# EAGLE design untitled (EAGLE 9.6.2)
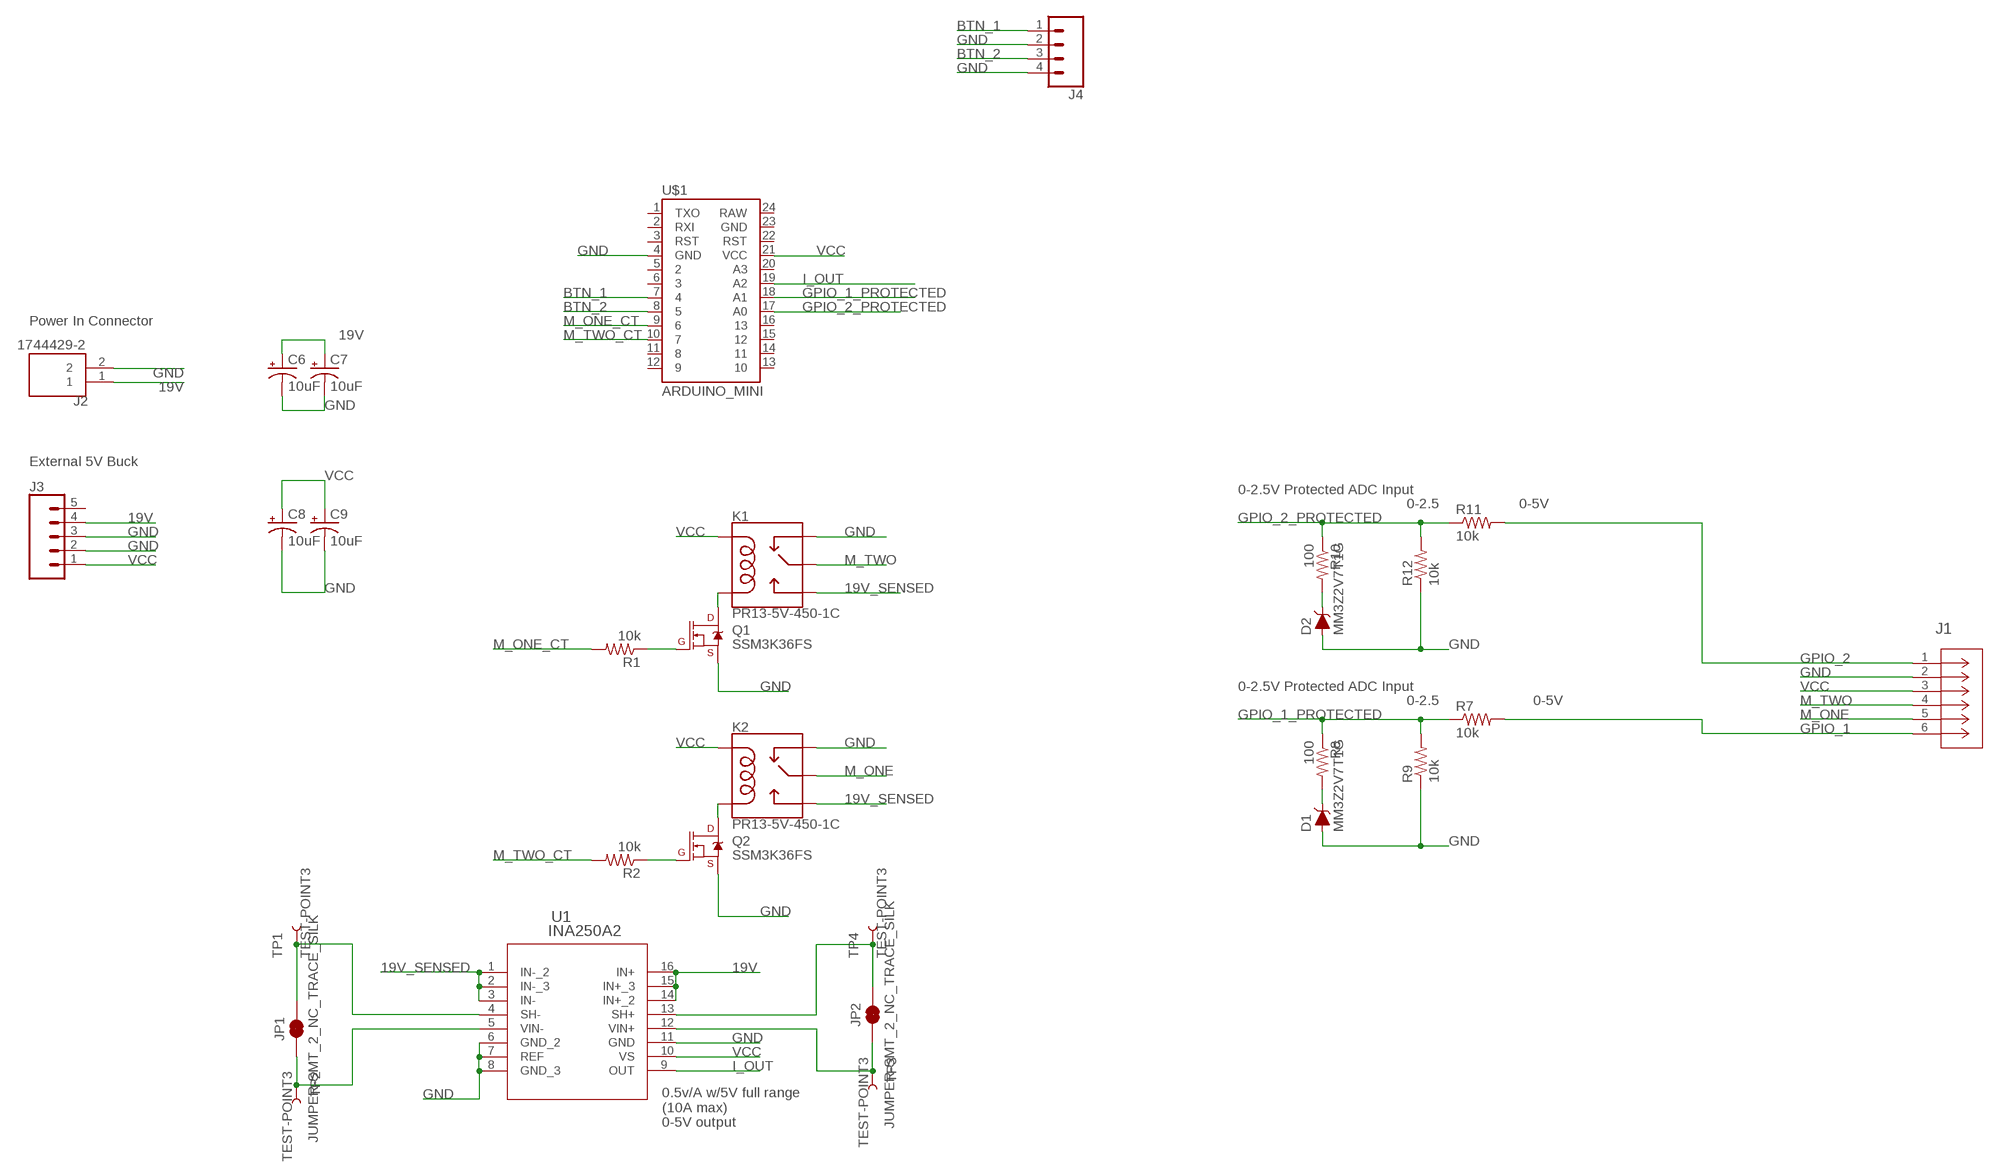
[diagram p0: schematic, sheet 1]

## Parts
C6  10uF  CPOL-USE2.5-6  [E2,5-6]
C7  10uF  CPOL-USE2.5-6  [E2,5-6]
C8  10uF  CPOL-USE2.5-6  [E2,5-6]
C9  10uF  CPOL-USE2.5-6  [E2,5-6]
D1  MM3Z2V7T1G  DIODE-ZENER-BZT52C3V6S  [SOD-323]
D2  MM3Z2V7T1G  DIODE-ZENER-BZT52C3V6S  [SOD-323]
J1  39301060  [CON_39301060]
J2  1744429-2  [TE_1744429-2]
J3  CONN_05  [1X05]
J4  CONN_041X04_NO_SILK  [1X04_NO_SILK]
JP1  JUMPER-SMT_2_NC_TRACE_SILK  [SMT-JUMPER_2_NC_TRACE_SILK]
JP2  JUMPER-SMT_2_NC_TRACE_SILK  [SMT-JUMPER_2_NC_TRACE_SILK]
K1  PR13-5V-450-1C  RELAY-SPDT  [RELAY_G5LE]
K2  PR13-5V-450-1C  RELAY-SPDT  [RELAY_G5LE]
Q1  SSM3K36FS  MOSFET-NCH-AO3404A  [SOT23-3]
Q2  SSM3K36FS  MOSFET-NCH-AO3404A  [SOT23-3]
R1  10k  R-US_R0805  [R0805]
R2  10k  R-US_R0805  [R0805]
R7  10k  R-US_R0805  [R0805]
R8  100  R-US_R0805  [R0805]
R9  10k  R-US_R0805  [R0805]
R10  100  R-US_R0805  [R0805]
R11  10k  R-US_R0805  [R0805]
R12  10k  R-US_R0805  [R0805]
TP1  TEST-POINT3  [PAD.03X.03]
TP2  TEST-POINT3  [PAD.03X.03]
TP3  TEST-POINT3  [PAD.03X.03]
TP4  TEST-POINT3  [PAD.03X.03]
U1  INA250A2  INA250A1PWPW16_TEX-M  [PW16_TEX-M]
U$1  ARDUINO_MINI  [ARDUINO_MINI]

## Nets
19V: C6.+ C7.+ J2.1 J3.4 U1.14(IN+_2) U1.15(IN+_3) U1.16(IN+)
19V_SENSED: K1.3(NO) K2.3(NO) U1.1(IN-_2) U1.2(IN-_3) U1.3(IN-)
BTN_1: J4.1 U$1.7
BTN_2: J4.3 U$1.8
GND: C6.- C7.- C8.- C9.- D1.A D2.A J1.2 J2.2 J3.2 J3.3 J4.2 J4.4 K1.4(NC) K2.4(NC) Q1.2(S) Q2.2(S) R9.1 R12.1 U1.6(GND_2) U1.7(REF) U1.8(GND_3) U1.11(GND) U$1.4(GND)
GPIO_1: J1.6 R7.2
GPIO_1_PROTECTED: R7.1 R8.1 R9.2 U$1.18(A1)
GPIO_2: J1.1 R11.2
GPIO_2_PROTECTED: R10.1 R11.1 R12.2 U$1.17(A0)
I_OUT: U1.9(OUT) U$1.19(A2)
M_ONE: J1.5 K2.1(MAIN)
M_ONE_CT: R1.2 U$1.9
M_TWO: J1.4 K1.1(MAIN)
M_TWO_CT: R2.2 U$1.10
N$1: JP1.1 TP2.1 U1.5(VIN-)
N$2: JP1.2 TP1.1 U1.4(SH-)
N$3: JP2.2 TP4.1 U1.13(SH+)
N$4: K1.5(COIL2) Q1.3(D)
N$5: K2.5(COIL2) Q2.3(D)
N$6: Q2.1(G) R2.1
N$7: D1.C R8.2
N$8: Q1.1(G) R1.1
N$9: D2.C R10.2
N$10: JP2.1 TP3.1 U1.12(VIN+)
VCC: C8.+ C9.+ J1.3 J3.1 K1.2(COIL1) K2.2(COIL1) U1.10(VS) U$1.21(VCC)
Unconnected: J3.5 U$1.1(TXO) U$1.2(RXI) U$1.3(RST) U$1.5 U$1.6 U$1.11 U$1.12 U$1.13 U$1.14 U$1.15 U$1.16 U$1.20(A3) U$1.22(RST) U$1.23(GND) U$1.24(RAW)

## Notes on the sheet
- Power In Connector
- External 5V Buck
- 0-2.5V Protected ADC Input
- 0-2.5 | 0-5V
- 0-2.5V Protected ADC Input
- 0-2.5 | 0-5V
- 0.5v/A w/5V full range
  (10A max)
  0-5V output

## Library data of the parts
C6-C9 = adafruit:CPOL-US: POLARIZED CAPACITOR, American symbol
D1 D2 = SparkFun-DiscreteSemi:DIODE-ZENER: Zener Diode A Zener diode allows current to flow from its anode to its cathode like a normal semiconductor diode, but it also permits current to flow in the reverse direction when its "Zener voltage" is reached. - WIkipedia; PROD_ID: DIO-08199; VALUE: 3.6V
J1 = 39301060:39301060; COPYRIGHT: Copyright (C) 2022 Ultra Librarian. All rights reserved.; MANUFACTURER_PART_NUMBER: 39301060; MFR_NAME: Molex Connector Corporation
J2 = 1744429-2:1744429-2: 3.96 EP HDR ASSY 6P W/PEGS, GW,NO PIN 3; MANUFACTURER: TE; PARTREV: R; STANDARD: Manufacturer Recommendations
J3 = SparkFun-Connectors:CONN_05: Multi connection point. Often used as Generic Header-pin footprint for 0.1 inch spaced/style header connections On any of the 0.1 inch spaced packages, you can populate with these: Break Away Headers - Straight <https://www.sparkfun.com/products/116> (PRT-00116) Break Away Male Headers - Right Angle <https://www.sparkfun.com/products/553> (PRT-00553) Female Headers <https://www.sparkfun.com/products/115> (PRT-00115) Break Away Headers - Machine Pin <https://www.sparkfun.com/products/117> (PRT-00117) Break Away Female Headers - Swiss Machine Pin <https://www.sparkfun.com/products/743> (PRT-00743) For SCREWTERMINALS and SPRING TERMINALS visit here: Screw Terimnals on SparkFun.com <https://www.sparkfun.com/search/results?term=Screw+Terminals> (5mm/3.5mm/2.54mm spacing) This device is also useful as a general connection point to wire up your design to another part of your project. Our various solder wires solder well into these plated through hole pads. Hook-Up Wire - Assortment (Stranded, 22 AWG) <https://www.sparkfun.com/products/11375> (PRT-11375) Hook-Up Wire - Assortment (Solid Core, 22 AWG) <https://www.sparkfun.com/products/11367> (PRT-11367) View the entire wire category on our website here <https://www.sparkfun.com/categories/141> Special notes: Molex polarized connector foot print use with SKU : PRT-08231 with associated crimp pins and housings. 1MM SMD Version SKU: PRT-10208
J4 = SparkFun-Connectors:CONN_04: Multi connection point. Often used as Generic Header-pin footprint for 0.1 inch spaced/style header connections On any of the 0.1 inch spaced packages, you can populate with these: Break Away Headers - Straight <https://www.sparkfun.com/products/116> (PRT-00116) Break Away Male Headers - Right Angle <https://www.sparkfun.com/products/553> (PRT-00553) Female Headers <https://www.sparkfun.com/products/115> (PRT-00115) Break Away Headers - Machine Pin <https://www.sparkfun.com/products/117> (PRT-00117) Break Away Female Headers - Swiss Machine Pin <https://www.sparkfun.com/products/743> (PRT-00743) For SCREWTERMINALS and SPRING TERMINALS visit here: Screw Terimnals on SparkFun.com <https://www.sparkfun.com/search/results?term=Screw+Terminals> (5mm/3.5mm/2.54mm spacing) This device is also useful as a general connection point to wire up your design to another part of your project. Our various solder wires solder well into these plated through hole pads. Hook-Up Wire - Assortment (Stranded, 22 AWG) <https://www.sparkfun.com/products/11375> (PRT-11375) Hook-Up Wire - Assortment (Solid Core, 22 AWG) <https://www.sparkfun.com/products/11367> (PRT-11367) View the entire wire category on our website here <https://www.sparkfun.com/categories/141> Special notes: Molex polarized connector foot print use with SKU : PRT-08231 with associated crimp pins and housings. 1MM SMD Version SKU: PRT-10208; PROD_ID: CONN-09696
JP1 JP2 = SparkFun-Jumpers:JUMPER-SMT_2_NC_TRACE: Normally closed trace jumper This jumper has a trace between two pads so it's normally closed (NC). Use a razor knife to open the connection. For best results follow the IPC guidelines for cutting traces: Cutout at least 0.063 mm (0.005 in). Remove all loose material to clean up the cut area. Seal the cut with an approved epoxy. Reapply solder to reclose the connection.
K1 K2 = SparkFun-Electromechanical:RELAY-SPDT: SPDT Electromechanical Relay Single-pole, double-throw sealed relays. When current is applied to the coil, it throws a simple changeover switch, terminating the connection from the NC contact to ground and closing the NO contact. Use them to switch high voltage/high current devices. SparkFun Products JQX-15F: Relay SPDT Sealed - 20A <https://www.sparkfun.com/products/10924> (COM-10924) JZC-11F: Relay SPDT Sealed <https://www.sparkfun.com/products/100> (COM-00100); PROD_ID: COMP-14214
Q1 Q2 = SparkFun-DiscreteSemi:MOSFET-NCH: N-channel MOSFETs Voltage controlled devices that allow control of high current outputs. SparkFun Products: SparkFun OpenScale <https://www.sparkfun.com/products/13261> SparkFun Digital Sandbox <https://www.sparkfun.com/products/12651> SparkFun Monster Moto Shield <https://www.sparkfun.com/products/10182> SparkFun MOSFET Power Controller <https://www.sparkfun.com/products/11214>; PROD_ID: TRANS-12988; VALUE: 5.8A/30V/35mΩ
R1 R2 R7-R12 = adafruit:R-US_: RESISTOR, American symbol
TP1-TP4 = SparkFun-Connectors:TEST-POINT: SparkFun Test Points Bare copper test points for troubleshooting or In-Circuit-Testing. These are used by our Production team for verifying production board runs using pogo-pins on test beds. SparkFun Products: SparkFun LSM9DS1 Breakout <https://www.sparkfun.com/products/13284> SparkFun PSOC <https://www.sparkfun.com/products/13714> SparkFun Load Cell Amplifier <https://www.sparkfun.com/products/13879>
U1 = INA250:INA250A1PW; COPYRIGHT: Copyright (C) 2022 Ultra Librarian. All rights reserved.; MANUFACTURER_PART_NUMBER: INA250A1PW; MFR_NAME: Texas Instruments
U$1 = SparkFun-Retired:ARDUINO_MINI: Arduino Pro Mini footprint

## Board
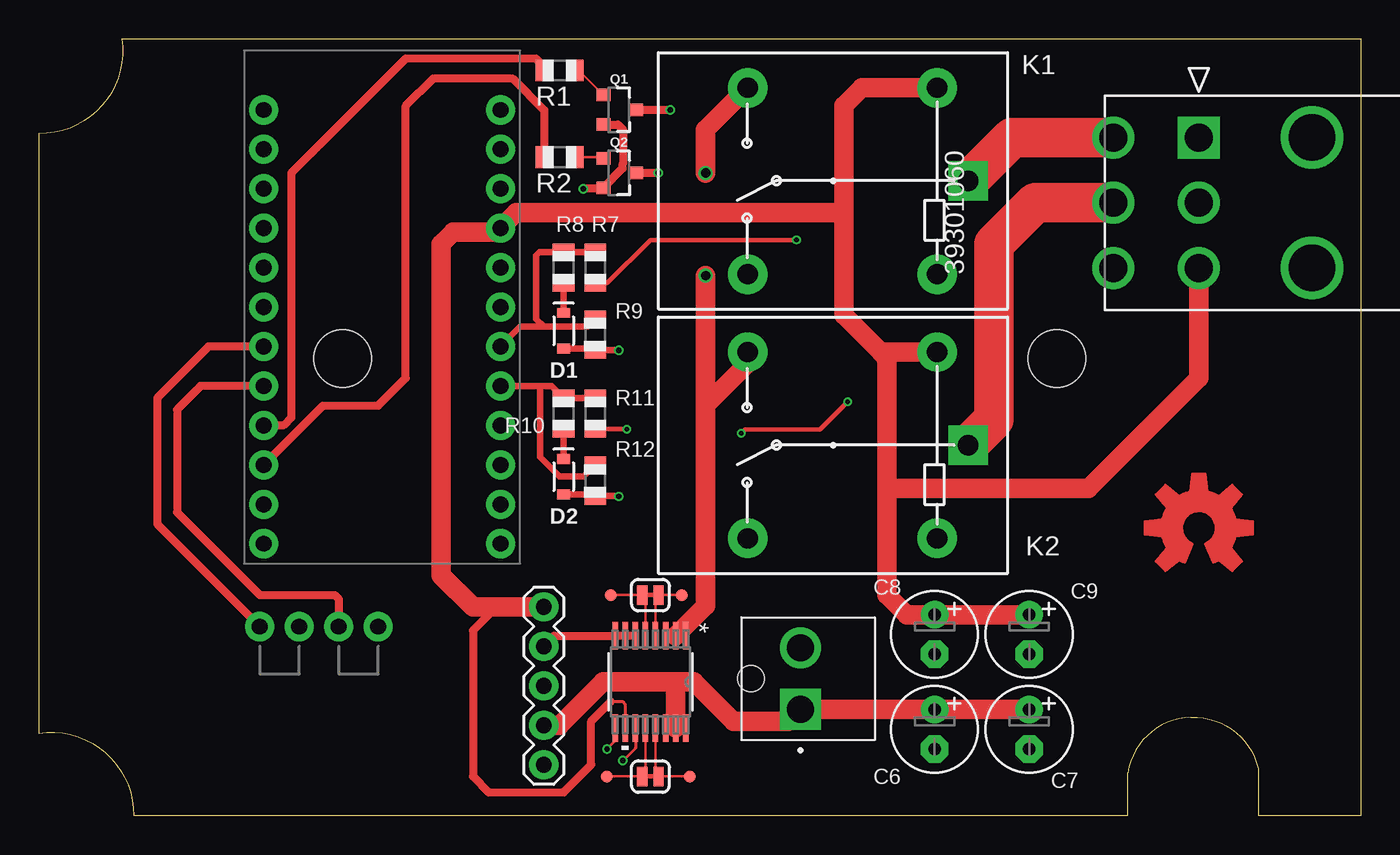
[diagram p1: board, top side]
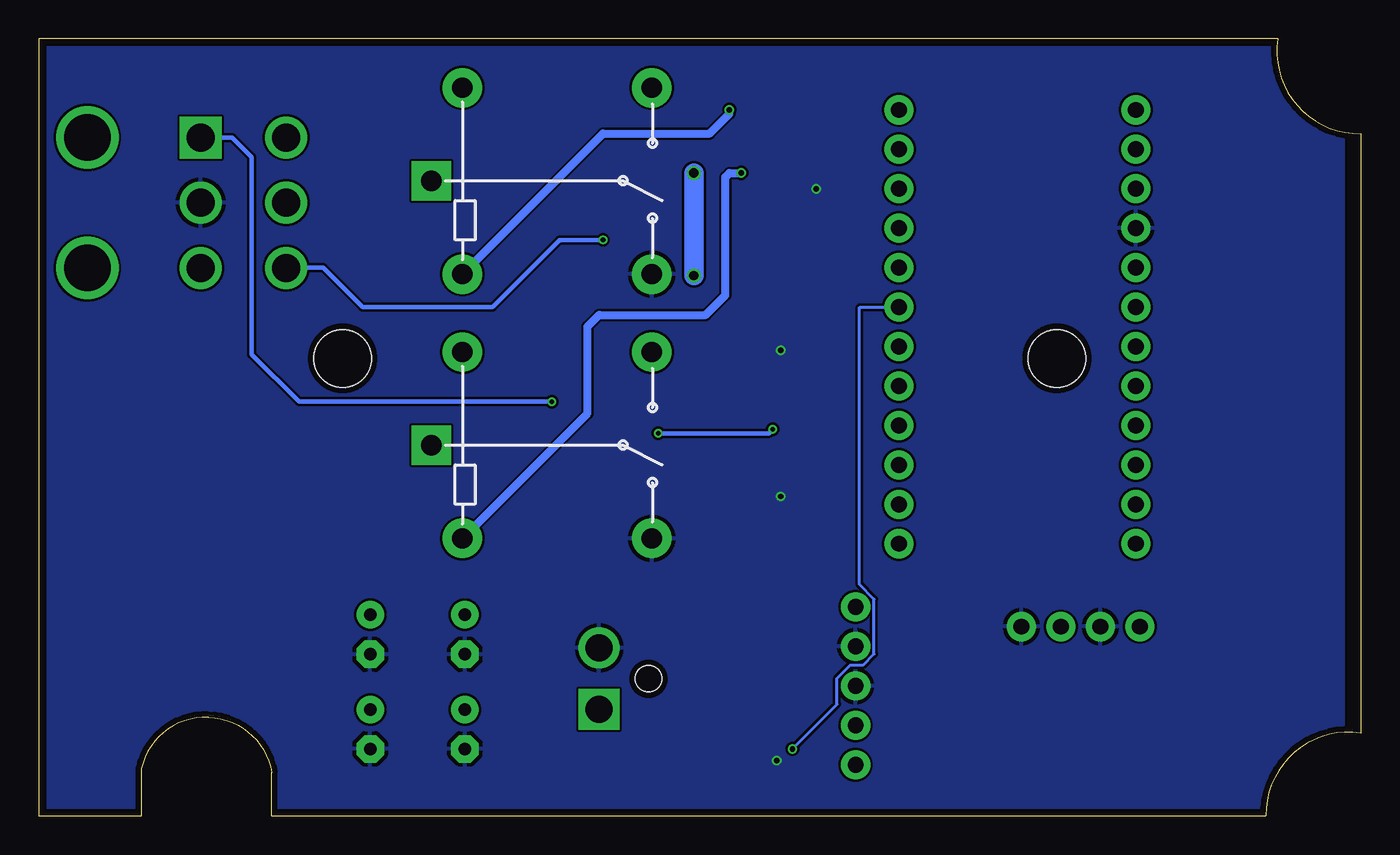
[diagram p2: board, bottom side, seen from below]

Size 85.09 x 50.04 mm. Coordinates in mm from the lower left corner, seen from the top.
Outline: 5.33,50.04 arc-100 0,43.94 0,5.33 arc-100 6.1,0 70.1,0 70.1,2.79 arc-80 74.17,6.35 arc-80 78.49,3.05 78.49,0 85.09,0 85.09,50.04 5.33,50.04
Copper layers (1*16): Top 0.035559375mm / dielectric 1.6mm / Bottom 0.035559375mm
Design rules "oshpark-2layer": minimum track width 6mil, minimum drill 10mil, track to track 6mil, track to pad 6mil, pad to pad 6mil, via to via 6mil, smd to smd 6mil, copper to edge 15mil, drill to drill 6mil, minimum pad ring 5mil, minimum via ring 5mil, stop-mask expansion 2.5mil, vias tented up to drill 0mil, thermal gap 10mil
Holes 3.7 mm at 19.56,29.46 65.53,29.46

### Footprints (pad centres in the part's own frame; a part is rotated, then mirrored left to right if it is on the bottom)
E2,5-6 = drill 0.813 pad 1.778: + -1.27,0 | drill 0.813 pad 1.778 octagon: - 1.27,0
SOD-323 = smd 0.63 x 0.83: A 1.15,0; C -1.15,0
CON_39301060 = drill 1.803 pad 2.311 square: 1 0,0 | drill 1.803 pad 2.311: 2 -4.191,0; 3 -8.407,0; 4 0,5.512; 5 -4.191,5.512; 6 -8.407,5.512 | drill 2.997 pad 2.997: M1 0,-7.29; M2 -8.407,-7.29
TE_1744429-2 = drill 1.75 pad 2.1 square: 1 0,0 | drill 1.75 pad 2.1: 2 3.96,0 | hole 1.68: 1.98,3.18; 1.98,3.18
1X05 = drill 1.016 pad 1.88: 1 0,0; 2 2.54,0; 3 5.08,0; 4 7.62,0; 5 10.16,0
1X04_NO_SILK = drill 1.016 pad 1.88: 1 0,0; 2 2.54,0; 3 5.08,0; 4 7.62,0
SMT-JUMPER_2_NC_TRACE_SILK = smd 0.66 x 1.27: 1 -0.521,0; 2 0.521,0
RELAY_G5LE = drill 1.3 pad 2.54 square: 1 8.52,-0.005 | drill 1.3 pad 2.54: 2 6.52,5.995; 3 -5.68,5.995; 4 -5.68,-6.005; 5 6.52,-6.005
SOT23-3 = smd 0.8 x 0.9: 1 -0.95,-1; 2 0.95,-1; 3 0,1.1
R0805 = smd 1.1 x 1.4: 1 -1,0; 2 1,0
PAD.03X.03 = smd 0.762 x 0.762: 1 0,0
PW16_TEX-M = smd 1.778 x 0.356: 1 -2.972,2.275; 2 -2.972,1.625; 3 -2.972,0.975; 4 -2.972,0.325; 5 -2.972,-0.325; 6 -2.972,-0.975; 7 -2.972,-1.625; 8 -2.972,-2.275; 9 2.972,-2.275; 10 2.972,-1.625; 11 2.972,-0.975; 12 2.972,-0.325; 13 2.972,0.325; 14 2.972,0.975; 15 2.972,1.625; 16 2.972,2.275
ARDUINO_MINI = drill 1.016 pad 1.88: 1 -7.62,12.7; 2 -7.62,10.16; 3 -7.62,7.62; 4 -7.62,5.08; 5 -7.62,2.54; 6 -7.62,0; 7 -7.62,-2.54; 8 -7.62,-5.08; 9 -7.62,-7.62; 10 -7.62,-10.16; 11 -7.62,-12.7; 12 -7.62,-15.24; 13 7.62,-15.24; 14 7.62,-12.7; 15 7.62,-10.16; 16 7.62,-7.62; 17 7.62,-5.08; 18 7.62,-2.54; 19 7.62,0; 20 7.62,2.54; 21 7.62,5.08; 22 7.62,7.62; 23 7.62,10.16; 24 7.62,12.7

### Placement (x,y rotation side)
C6  57.66,5.59 270 top
C7  63.75,5.59 270 top
C8  57.66,11.68 270 top
C9  63.75,11.68 270 top
D1  33.78,31.24 270 top
D2  33.78,21.84 270 top
J1  74.68,43.69 90 top
J2  49.02,6.86 90 top
J3  32.51,13.46 270 top
J4  14.22,12.19 0 top
JP1  39.37,14.22 0 top
JP2  39.37,2.54 0 top
K1  51.31,40.89 0 top
K2  51.31,23.88 0 top
Q1  37.34,45.47 270 top
Q2  37.34,41.4 270 top
R1  33.53,48.01 180 top
R2  33.53,42.42 180 top
R7  35.81,35.31 270 top
R8  33.78,35.31 270 top
R9  35.81,30.99 90 top
R10  33.78,25.91 270 top
R11  35.81,25.91 270 top
R12  35.81,21.59 90 top
TP1  41.4,14.22 0 top
TP2  36.83,14.22 0 top
TP3  36.58,2.54 0 top
TP4  41.91,2.54 0 top
U1  39.37,8.64 270 top
U$1  22.1,32.77 0 top
U$2  [OSHW-LOGO-L_COPPER]  74.68,18.54 0 top

### Tracks (layer width: path | path; a pad name or v marks a point on that pad's centre or on a via)
19V
  Top 0.254: U1.14 U1.15 U1.16
  Top 1.27: J3.4 33.53,5.84 36.32,8.64 40.89,8.64 | 40.89,8.64 42.16,8.64 44.7,6.1 48.26,6.1 J2.1 C6.+ C7.+ | U1.15 40.99,8.54 40.89,8.64
19V_SENSED  (via drill 0.6)
  Top 0.254: U1.3 U1.2 U1.1
  Top 1.27: U1.2 42.93,13.54 42.93,26.42 | K1.3 42.93,44.19 v42.93,41.4 | K2.3 45.63,29.12 42.93,26.42 | v42.93,34.8 42.93,26.42
  Bottom 1.27: v42.93,41.4 v42.93,34.8
BTN_1
  Top 0.508: U$1.7 10.92,30.23 7.62,26.92 7.62,18.8 J4.1
BTN_2
  Top 0.508: U$1.8 10.41,27.69 8.89,26.16 8.89,19.56 14.22,14.22 19.05,14.22 19.3,13.97 J4.3
GND  (via drill 0.35)
  Top 0.203: U1.11 38.4,4.36 v37.59,3.56
  Top 0.254: U1.7 U1.6
  Top 0.406: D1.A 35.71,30.09 R9.1 37.32,29.99 v37.34,29.97 | D2.A 35.71,20.69 R12.1 37.32,20.59 v37.34,20.57
  Top 0.508: Q1.2 37.27,44.52 37.59,44.2 37.59,41.98 37.58,41.97 37.58,41.7 Q2.2 36.27,40.39 v35.05,40.39 | J3.2 33.2,11.61 U1.8 U1.6
  pour Bottom: 1.02,49.53 84.58,49.53 84.58,0.51 1.02,0.51
GPIO_1  (via drill 0.3)
  Top 0.305: R7.2 36.59,34.31 39.37,37.08 v48.77,37.08
  Bottom 0.305: v48.77,37.08 51.56,37.08 55.88,32.77 64.26,32.77 66.8,35.31 69.14,35.31 J1.6
GPIO_1_PROTECTED
  Top 0.406: R7.1 R8.1 32.24,36.31 32,36.07 32,32 32.51,31.5 | 32.51,31.5 35.32,31.5 R9.2 | U$1.18 30.99,31.5 32.51,31.5
GPIO_2  (via drill 0.3)
  Top 0.305: v52.07,26.67 50.29,24.89 45.47,24.89 v45.21,24.64 | R11.2 37.83,24.91 v37.85,24.89
  Bottom 0.305: J1.1 72.64,43.69 71.37,42.42 71.37,29.72 68.33,26.67 v52.07,26.67 | v45.21,24.64 38.1,24.64 v37.85,24.89
GPIO_2_PROTECTED
  Top 0.406: R11.1 R10.1 33,27.69 32.26,27.69 | U$1.17 32.26,27.69 | R12.2 35.07,21.84 33.53,21.84 32.26,23.11 32.26,27.69
I_OUT  (via drill 0.35)
  Top 0.203: U1.9 37.09,4.84 v36.58,4.32
  Bottom 0.203: v36.58,4.32 33.71,7.19 33.71,8.88 32.85,9.73 32.02,9.73 31.32,10.43 31.32,13.96 32.26,14.9 32.26,32.77 U$1.19
M_ONE
  Top 2.54: K2.1 61.47,25.51 61.47,36.83 64.14,39.5 J1.5
M_ONE_CT
  Top 0.508: R1.2 32.53,48.24 32,48.77 23.62,48.77 16.26,41.4 16.26,25.65 15.75,25.15 U$1.9
M_TWO
  Top 2.54: J1.4 62.63,43.69 K1.1
M_TWO_CT
  Top 0.508: U$1.10 18.29,26.42 21.84,26.42 23.62,28.19 23.62,45.72 25.4,47.5 30.48,47.5 32.53,45.45 R2.2
N$1
  Top 0.152: U1.5 39.05,14.03 JP1.1 TP2.1
N$2
  Top 0.152: U1.4 39.7,14.03 JP1.2 TP1.1
N$3
  Top 0.152: U1.13 39.7,2.74 JP2.2 TP4.1
N$4  (via drill 0.35)
  Top 0.508: Q1.3 v40.64,45.47
  Bottom 0.508: K1.5 48.77,43.94 41.91,43.94 40.64,45.21 v40.64,45.47
N$5  (via drill 0.35)
  Top 0.508: v39.88,41.4 Q2.3
  Bottom 0.508: K2.5 49.78,25.91 49.78,31.5 49.02,32.26 42.16,32.26 40.89,33.53 40.89,41.15 40.64,41.4 v39.88,41.4
N$6
  Top 0.152: R2.1 36.27,42.42 Q2.1
N$7
  Top 0.406: D1.C R8.2
N$8
  Top 0.152: R1.1 34.75,48.01 Q1.1
N$9
  Top 0.406: D2.C R10.2
N$10
  Top 0.152: U1.12 39.05,2.74 JP2.1 | JP2.1 | TP3.1 JP2.1
VCC
  Top 0.203: 36.83,7.37 37.59,7.37 37.74,7.21 U1.10
  Top 0.406: 27.94,37.59 28.19,37.85 U$1.21
  Top 0.508: J3.1 29.46,13.46 27.94,11.94 27.94,2.54 28.96,1.52 33.78,1.52 35.56,3.3 35.56,6.1 36.83,7.37
  Top 1.27: K2.2 54.2,29.87 | 54.2,29.87 51.82,32.26 51.82,38.86 | 51.82,38.86 51.82,45.72 52.98,46.89 K1.2 | 51.82,38.86 30.73,38.86 U$1.21 29.46,37.59 26.67,37.59 25.91,36.83 25.91,15.49 27.94,13.46 J3.1 | 54.2,29.87 54.61,29.46 54.61,21.08 | 54.61,21.08 54.61,14.22 55.88,12.95 C8.+ C9.+ | 54.61,21.08 67.56,21.08 74.68,28.19 J1.3

### Text on the board
Document: VCC | GND | GND | 19V
tDocu: Smart Standing Desk Controller / Aidan Chandra 2022 | BTN1 | BTN2